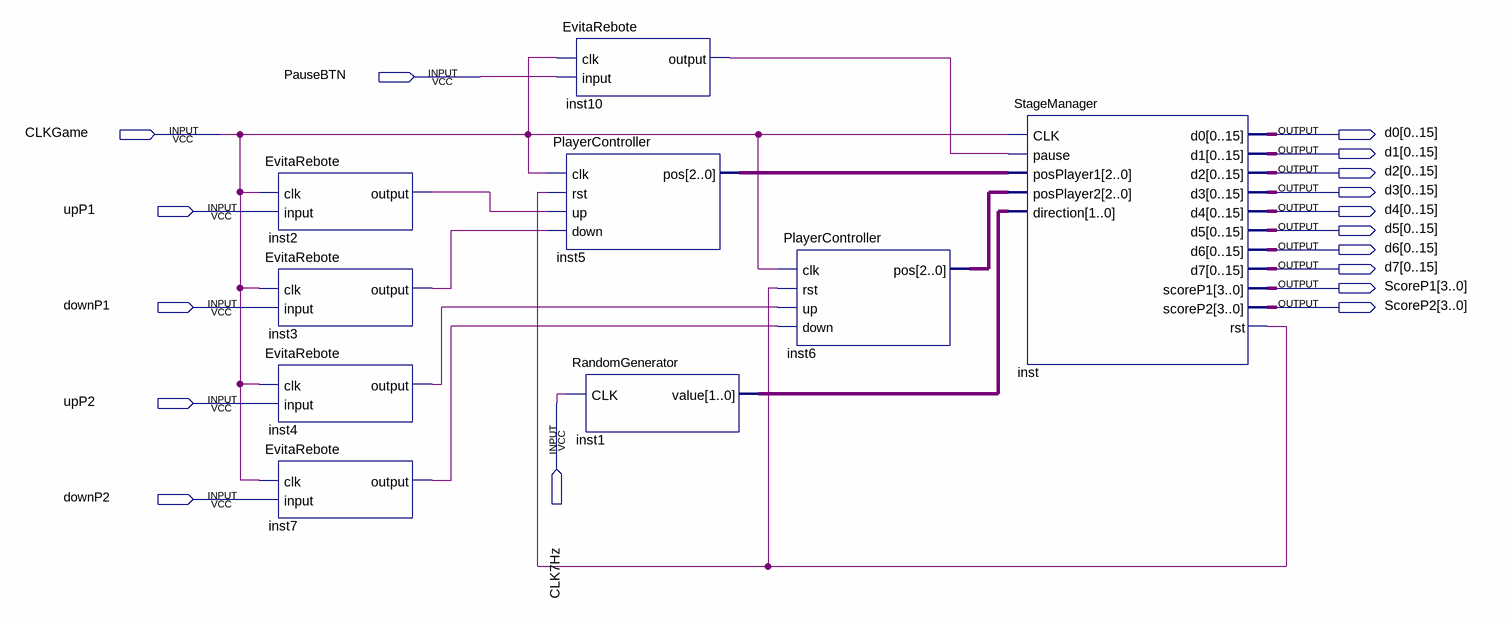
[diagram p0: schematic sheet]
// Quartus schematic GameManager.bdf as structural Verilog: 9 symbols, 17 pins
module GameManager (
  input  PauseBTN,
  input  CLKGame,
  input  upP1,
  input  downP1,
  input  upP2,
  input  CLK7Hz,
  input  downP2,
  output [0:15] d0,
  output [0:15] d1,
  output [0:15] d2,
  output [0:15] d3,
  output [0:15] d4,
  output [0:15] d5,
  output [0:15] d6,
  output [0:15] d7,
  output [3:0] ScoreP1,
  output [3:0] ScoreP2
);

  wire inst2_output, inst3_output, inst4_output, inst7_output, inst10_output, inst_rst;
  wire [1:0] inst1_value;
  wire [2:0] inst5_pos, inst6_pos;

  EvitaRebote inst2 (.clk(CLKGame), .\input (upP1), .\output (inst2_output));
  EvitaRebote inst3 (.clk(CLKGame), .\input (downP1), .\output (inst3_output));
  EvitaRebote inst4 (.clk(CLKGame), .\input (upP2), .\output (inst4_output));
  EvitaRebote inst7 (.clk(CLKGame), .\input (downP2), .\output (inst7_output));
  EvitaRebote inst10 (.clk(CLKGame), .\input (PauseBTN), .\output (inst10_output));
  PlayerController inst5 (.clk(CLKGame), .rst(inst_rst), .up(inst2_output), .down(inst3_output), .pos(inst5_pos));
  RandomGenerator inst1 (.CLK(CLK7Hz), .value(inst1_value));
  PlayerController inst6 (.clk(CLKGame), .rst(inst_rst), .up(inst4_output), .down(inst7_output), .pos(inst6_pos));
  StageManager inst (
    .CLK(CLKGame), .pause(inst10_output), .posPlayer1(inst5_pos), .posPlayer2(inst6_pos),
    .direction(inst1_value), .d0(d0), .d1(d1), .d2(d2), .d3(d3), .d4(d4), .d5(d5), .d6(d6), .d7(d7),
    .rst(inst_rst), .scoreP1(ScoreP1), .scoreP2(ScoreP2));
endmodule
